# EAGLE design Debug (EAGLE 9.4.2)
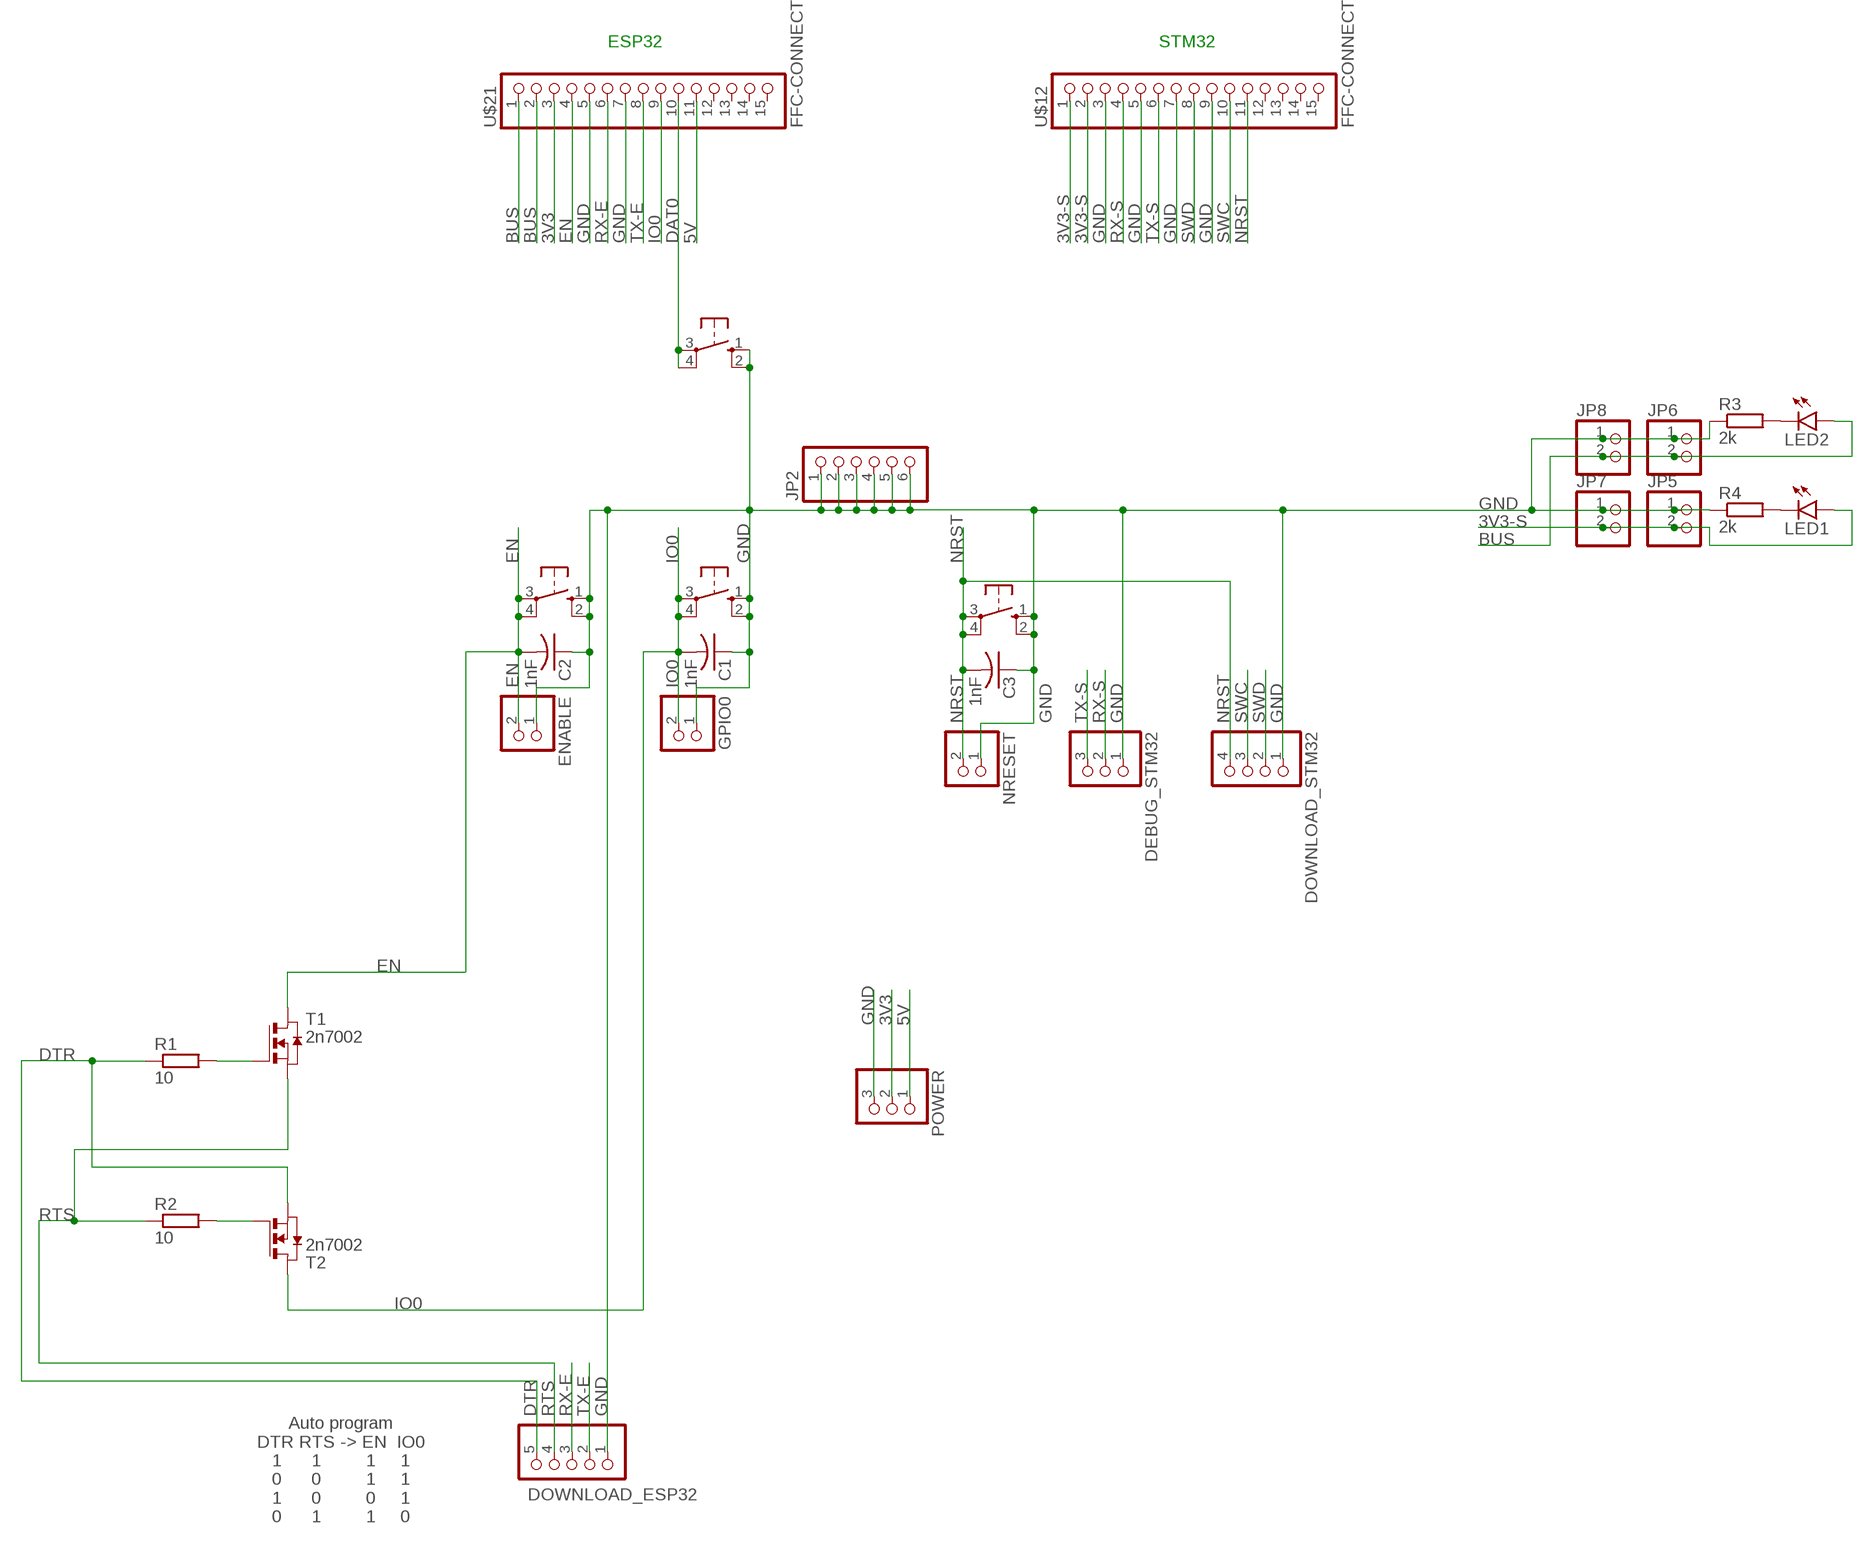
[diagram p0: schematic, sheet 1]

## Parts
C1  1nF  C-USC0603  [C0603]
C2  1nF  C-USC0603  [C0603]
C3  1nF  C-USC0603  [C0603]
DAT0  10-XX  [B3F-10XX]
DEBUG_STM32  PINHD-1X3  [1X03]
DOWNLOAD_ESP32  PINHD-1X5  [1X05]
DOWNLOAD_STM32  PINHD-1X4  [1X04]
EN  10-XX  [B3F-10XX]
ENABLE  PINHD-1X2  [1X02]
GPIO0  PINHD-1X2  [1X02]
IO0  10-XX  [B3F-10XX]
JP2  PINHD-1X6  [1X06]
JP5  PINHD-1X2  [1X02]
JP6  PINHD-1X2  [1X02]
JP7  PINHD-1X2  [1X02]
JP8  PINHD-1X2  [1X02]
LED1  LEDCHIPLED_0603  [CHIPLED_0603]
LED2  LEDCHIPLED_0603  [CHIPLED_0603]
NRESET  PINHD-1X2  [1X02]
NRST  10-XX  [B3F-10XX]
POWER  PINHD-1X3  [1X03]
R1  10  R-EU_R0603  [R0603]
R2  10  R-EU_R0603  [R0603]
R3  2k  R-EU_R0603  [R0603]
R4  2k  R-EU_R0603  [R0603]
T1  2n7002  NMOSSOT23  [SOT-23]
T2  2n7002  NMOSSOT23  [SOT-23]
U$12  FFC-CONNECT  [SLW15S]
U$21  FFC-CONNECT  [SLW15S]

## Nets
3V3: POWER.2 U$21.3
3V3-S: JP5.2 JP7.2 LED1.A U$12.1 U$12.2
5V: POWER.1 U$21.11
BUS: JP6.2 JP8.2 LED2.A U$21.1 U$21.2
DAT0: DAT0.3(P) DAT0.4(P1) U$21.10
DTR: DOWNLOAD_ESP32.5 R1.1 T2.2(S)
EN: C2.2 EN.3(P) EN.4(P1) ENABLE.2 T1.1(D) U$21.4
GND: C1.1 C2.1 C3.1 DAT0.1(S) DAT0.2(S1) DEBUG_STM32.1 DOWNLOAD_ESP32.1 DOWNLOAD_STM32.1 EN.1(S) EN.2(S1) ENABLE.1 GPIO0.1 IO0.1(S) IO0.2(S1) JP2.1 JP2.2 JP2.3 JP2.4 JP2.5 JP2.6 JP5.1 JP6.1 JP7.1 JP8.1 NRESET.1 NRST.1(S) NRST.2(S1) POWER.3 R3.1 R4.1 U$12.3 U$12.5 U$12.7 U$12.9 U$21.5 U$21.7
IO0: C1.2 GPIO0.2 IO0.3(P) IO0.4(P1) T2.1(D) U$21.9
N$1: R2.2 T2.3(G)
N$2: R1.2 T1.3(G)
N$3: LED1.C R4.2
N$4: LED2.C R3.2
NRST: C3.2 DOWNLOAD_STM32.4 NRESET.2 NRST.3(P) NRST.4(P1) U$12.11
RTS: DOWNLOAD_ESP32.4 R2.1 T1.2(S)
RX-E: DOWNLOAD_ESP32.3 U$21.6
RX-S: DEBUG_STM32.2 U$12.4
SWC: DOWNLOAD_STM32.3 U$12.10
SWD: DOWNLOAD_STM32.2 U$12.8
TX-E: DOWNLOAD_ESP32.2 U$21.8
TX-S: DEBUG_STM32.3 U$12.6
Unconnected: U$12.12 U$12.13 U$12.14 U$12.15 U$21.12 U$21.13 U$21.14 U$21.15

## Notes on the sheet
- ESP32 | STM32
- Auto program
  DTR RTS -> EN  IO0
  1      1         1     1
  0      0         1     1
  1      0         0     1
  0      1         1     0

## Library data of the parts
C1-C3 = rcl:C-US: CAPACITOR, American symbol; SPICEPREFIX: C
DAT0 EN IO0 NRST = switch-omron:10-XX: OMRON SWITCH; MPN: B3F-1000; OC_FARNELL: 176432; OC_NEWARK: 36M3542
DEBUG_STM32 POWER = pinhead:PINHD-1X3: PIN HEADER
DOWNLOAD_ESP32 = pinhead:PINHD-1X5: PIN HEADER
DOWNLOAD_STM32 = pinhead:PINHD-1X4: PIN HEADER
ENABLE GPIO0 JP5-JP8 NRESET = pinhead:PINHD-1X2: PIN HEADER
JP2 = pinhead:PINHD-1X6: PIN HEADER
LED1 LED2 = led:LED: LED OSRAM: - CHIPLED LG R971, LG N971, LY N971, LG Q971, LY Q971, LO R971, LY R971 LH N974, LH R974 LS Q976, LO Q976, LY Q976 LO Q996 - Hyper CHIPLED LW Q18S LB Q993, LB Q99A, LB R99A - SideLED LS A670, LO A670, LY A670, LG A670, LP A670 LB A673, LV A673, LT A673, LW A673 LH A674 LY A675 LS A676, LA A676, LO A676, LY A676, LW A676 LS A679, LY A679, LG A679 - Hyper Micro SIDELED® LS Y876, LA Y876, LO Y876, LY Y876 LT Y87S - SmartLED LW L88C, LW L88S LB L89C, LB L89S, LG L890 LS L89K, LO L89K, LY L89K LS L896, LA L896, LO L896, LY L896 - TOPLED LS T670, LO T670, LY T670, LG T670, LP T670 LSG T670, LSP T670, LSY T670, LOP T670, LYG T670 LG T671, LOG T671, LSG T671 LB T673, LV T673, LT T673, LW T673 LH T674 LS T676, LA T676, LO T676, LY T676, LB T676, LH T676, LSB T676, LW T676 LB T67C, LV T67C, LT T67C, LS T67K, LO T67K, LY T67K, LW E67C LS E67B, LA E67B, LO E67B, LY E67B, LB E67C, LV E67C, LT E67C LW T67C LS T679, LY T679, LG T679 LS T770, LO T770, LY T770, LG T770, LP T770 LB T773, LV T773, LT T773, LW T773 LH T774 LS E675, LA E675, LY E675, LS T675 LS T776, LA T776, LO T776, LY T776, LB T776 LHGB T686 LT T68C, LB T68C - Hyper Mini TOPLED® LB M676 - Mini TOPLED Santana® LG M470 LS M47K, LO M47K, LY M47K Source: http://www.osram.convergy.de LUXEON: - LUMILED® LXK2-PW12-R00, LXK2-PW12-S00, LXK2-PW14-U00, LXK2-PW14-V00 LXK2-PM12-R00, LXK2-PM12-S00, LXK2-PM14-U00 LXK2-PE12-Q00, LXK2-PE12-R00, LXK2-PE12-S00, LXK2-PE14-T00, LXK2-PE14-U00 LXK2-PB12-K00, LXK2-PB12-L00, LXK2-PB12-M00, LXK2-PB14-N00, LXK2-PB14-P00, LXK2-PB14-Q00 LXK2-PR12-L00, LXK2-PR12-M00, LXK2-PR14-Q00, LXK2-PR14-R00 LXK2-PD12-Q00, LXK2-PD12-R00, LXK2-PD12-S00 LXK2-PH12-R00, LXK2-PH12-S00 LXK2-PL12-P00, LXK2-PL12-Q00, LXK2-PL12-R00 Source: www.luxeon.com KINGBRIGHT: KA-3528ASYC Source: www.kingbright.com
R1-R4 = rcl:R-EU_: RESISTOR, European symbol; SPICEPREFIX: R
T1 T2 = zetex:NMOSSOT23: MOS FET; OC_FARNELL: unknown; OC_NEWARK: unknown
U$12 U$21 = CanCubeSat:FFC-CONNECT

## Board
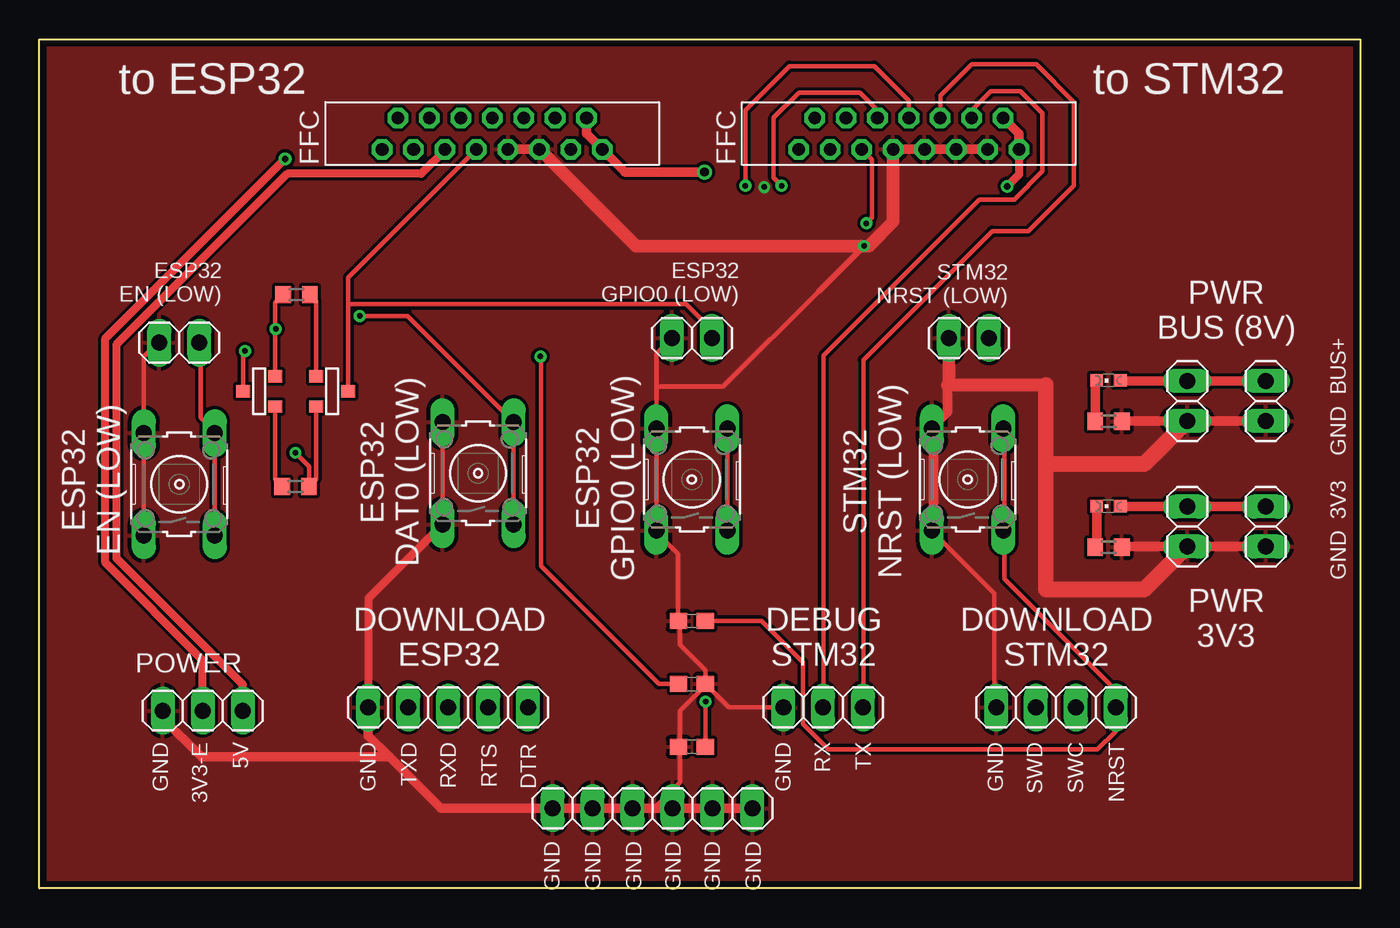
[diagram p1: board, top side]
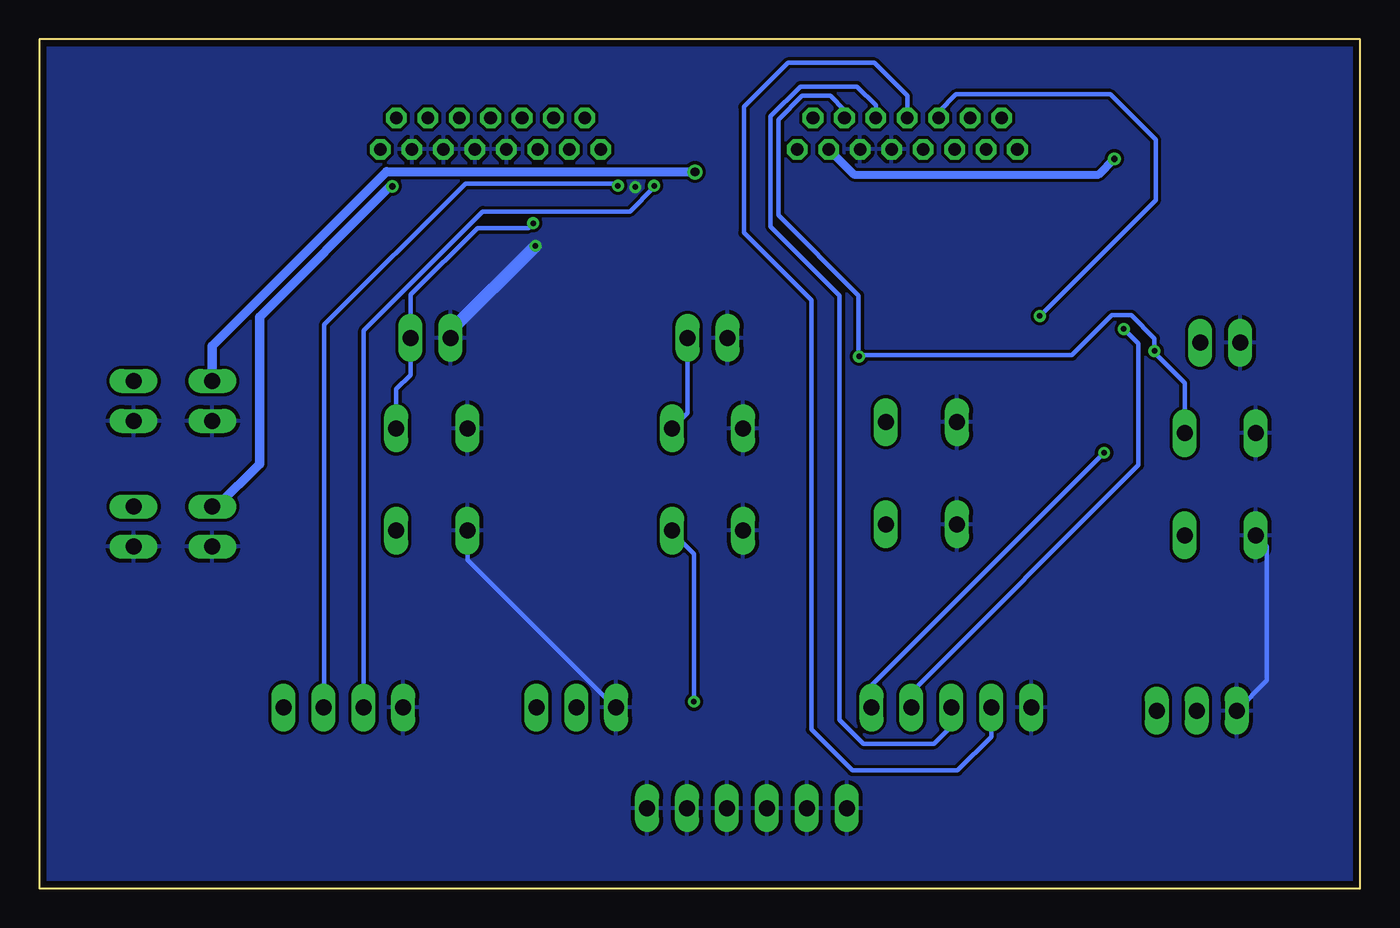
[diagram p2: board, bottom side, seen from below]

Size 84 x 54 mm. Coordinates in mm from the lower left corner, seen from the top.
Outline: 0,0 0,54 84,54 84,0 0,0
Copper layers (1*16): Top 0.035mm / dielectric 1.5mm / Bottom 0.035mm
Design rules "default *": minimum track width 0.3mm, minimum drill 0.35mm, track to track 0.2mm, track to pad 0.2mm, pad to pad 0.2mm, via to via 0.2mm, smd to smd 0.2mm, copper to edge 0.4mm, drill to drill 6mil, minimum pad ring 10mil, minimum via ring 8mil, stop-mask expansion 4mil, vias tented up to drill 0mil, thermal gap 10mil

### Footprints (pad centres in the part's own frame; a part is rotated, then mirrored left to right if it is on the bottom)
C0603 = smd 1.1 x 1: 1 -0.85,0; 2 0.85,0
B3F-10XX = drill 1.016 long: 1 -3.251,2.261; 2 3.251,2.261; 3 -3.251,-2.261; 4 3.251,-2.261
1X03 = drill 1.016 long: 1 -2.54,0; 2 0,0; 3 2.54,0
1X05 = drill 1.016 long: 1 -5.08,0; 2 -2.54,0; 3 0,0; 4 2.54,0; 5 5.08,0
1X04 = drill 1.016 long: 1 -3.81,0; 2 -1.27,0; 3 1.27,0; 4 3.81,0
1X02 = drill 1.016 long: 1 -1.27,0; 2 1.27,0
1X06 = drill 1.016 long: 1 -6.35,0; 2 -3.81,0; 3 -1.27,0; 4 1.27,0; 5 3.81,0; 6 6.35,0
CHIPLED_0603 = smd 0.8 x 0.8: A 0,-0.75; C 0,0.75
R0603 = smd 1 x 1.1: 1 -0.85,0; 2 0.85,0
SOT-23 = smd 0.787 x 0.889: 1 0.025,-1.016; 2 -0.94,1.016; 3 0.991,1.016
SLW15S = drill 0.8 octagon: 1 7,-1; 2 6,1; 3 5,-1; 4 4,1; 5 3,-1; 6 2,1; 7 1,-1; 8 0,1; 9 -1,-1; 10 -2,1; 11 -3,-1; 12 -4,1; 13 -5,-1; 14 -6,1; 15 -7,-1

### Placement (x,y rotation side)
C1  41.5,9 0 top
C2  41.5,13 180 top
C3  41.5,17 0 top
DAT0  27.9,26.4 90 top
DEBUG_STM32  49.85,11.5 0 top
DOWNLOAD_ESP32  26,11.5 0 top
DOWNLOAD_STM32  64.66,11.5 0 top
EN  8.9,25.7 90 top
ENABLE  8.9,34.7 0 top
GPIO0  41.5,35 0 top
IO0  41.5,26 90 top
JP2  39,5.09 0 top
JP5  73,23 90 top
JP6  73,31 90 top
JP7  78,23 90 top
JP8  78,31 90 top
LED1  68,24.3 90 top
LED2  68,32.3 90 top
NRESET  59.12,35 0 top
NRST  59.04,26 90 top
POWER  10.4,11.3 180 top
R1  16.3,25.56 180 top
R2  16.35,37.76 0 top
R3  68,29.7 180 top
R4  68,21.7 180 top
T1  13.99,31.63 270 top
T2  18.62,31.58 90 top
U$12  55.3,48 0 top
U$21  28.8,48 0 top

### Tracks (layer width: path | path; a pad name or v marks a point on that pad's centre or on a via)
3V3  (via drill 0.4)
  Top 0.5: POWER.2 10.4,14.51 4.2,20.71 4.2,34.97 v15.63,46.4
  Bottom 0.5: v15.63,46.4 16.64,45.4 32.2,45.4 U$21.3
3V3-S  (via drill 0.4)
  Top 0.5: U$12.1 62.3,45.4 v61.55,44.65
  Top 0.6: JP7.2 JP5.2 68.78,24.27 LED1.A | U$12.2 62.3,48 U$12.1
  Bottom 0.5: v61.55,44.65 61.62,44.72
  Bottom 0.6: 61.62,44.72 70,36.34 70,27 72.73,24.27 JP5.2
5V
  Top 0.5: U$21.11 25.8,46.96 24.29,45.45 15.78,45.45 4.9,34.58 4.9,21 12.94,12.96 POWER.1
BUS  (via drill 0.55)
  Top 0.6: JP8.2 JP6.2 68.78,32.27 LED2.A | U$21.2 34.8,48 U$21.1 37.24,45.56 v42.3,45.56
  Bottom 0.6: JP6.2 73,34.48 61.9,45.57 v42.3,45.56
DAT0  (via drill 0.35)
  Top 0.3: DAT0.3 DAT0.4 23.41,36.4 v20.38,36.4
  Bottom 0.3: U$21.10 26.8,49.4 25.7,50.5 15.9,50.5 13,47.6 13,43.77 v20.37,36.4 v20.38,36.4
DTR  (via drill 0.35)
  Top 0.3: T2.2 17.6,26.01 R1.1 17.15,26.84 v16.29,27.7
  Bottom 0.3: DOWNLOAD_ESP32.5 31.08,12.91 v16.29,27.7
EN  (via drill 0.35)
  Top 0.3: EN.3 EN.4 11.15,29.07 10.28,29.95 10.28,34.7 ENABLE.2 | T1.1 12.97,34.07 v13.08,34.18 | C2.2 39.4,13 31.9,20.5 31.9,33.79 v31.86,33.83
  Bottom 0.3: EN.4 11.16,32.15 13.08,34.07 v13.08,34.18 13.08,34.98 14.55,36.45 15.78,36.45 18.33,33.9 31.79,33.9 v31.86,33.83 31.9,33.86 31.9,37.7 37,42.8 37,48.9 35.5,50.4 33.7,50.4 32.8,49.5 U$21.4
GND  (via drill 0.35)
  Top 0.3: 56.88,22.75 NRST.1 56.88,22.62 60.75,18.75 60.75,11.5 DOWNLOAD_STM32.1 | 56.88,29.25 NRST.2 56.88,29.38 | EN.1 EN.2 6.65,29.07 6.65,33.83 7.53,34.7 ENABLE.1 | 40.75,9 40.75,11.3 42.35,12.9 C2.1 | 40.75,9 C1.1 | C2.1 42.35,13.88 40.75,15.47 40.75,17 C3.1 40.62,17 40.62,21.25 39.25,22.62 IO0.1 IO0.2 39.24,31.9 | DEBUG_STM32.1 43.88,11.5 42.38,13 C2.1 | 39.24,31.9 39.24,34.01 GPIO0.1 | 40.75,9 40.75,6.74 39.1,5.09 | DAT0.2 DAT0.1 | 49.62,38.02 43.49,31.9 39.24,31.9
  Top 0.4: v52.45,40.86 49.62,38.02
  Top 0.5: DAT0.1 20.92,18.43 DOWNLOAD_ESP32.1
  Top 0.6: 56.88,29.25 56.88,22.75 | 57.75,32 57.75,30.25 56.88,29.38 | JP8.1 JP6.1 68.88,29.73 R3.1 | JP7.1 JP5.1 68.88,21.73 R4.1 | JP2.6 JP2.5 JP2.4 39.1,5.09 JP2.3 JP2.2 JP2.1 25.54,5.09 22.26,8.36 | 22.26,8.36 20.92,9.71 DOWNLOAD_ESP32.1 | 22.26,8.36 10.32,8.36 7.86,10.82 POWER.3 | U$21.5 U$21.7 | U$12.3 U$12.5 U$12.7 U$12.9
  Top 0.8: U$12.9 54.3,42.41 52.75,40.86 v52.45,40.86 37.94,40.86 U$21.5 | 64,32 57.75,32 57.85,32.1 NRESET.1
  Top 1: 64,32 64,27 | 64,27 64,19 70.27,19 JP5.1 | JP6.1 70.27,27 64,27
  Bottom 0.3: EN.1 6.53,22.32 5.95,21.75 5.95,13.21 POWER.3 | NRST.1 56.75,22.62 56.75,20.88 47.38,11.5 DEBUG_STM32.1
  Bottom 0.8: NRESET.1 57.85,35.46 v52.45,40.86
  other vias: 46.1,44.6
  pour Top: 0.4,53.6 83.6,53.6 83.6,0.4 0.4,0.4
  pour Bottom: 0.4,53.6 83.6,53.6 83.6,0.4 0.4,0.4
IO0  (via drill 0.35)
  Top 0.3: v42.38,11.88 42.38,9 C1.2 | IO0.4 IO0.3 | 19.65,37.15 T2.1 | U$21.9 19.65,38.85 19.65,37.15 | 19.65,37.15 41.12,37.15 42.77,35.5 GPIO0.2
  Bottom 0.3: v42.38,11.88 42.38,21.25 43.75,22.62 IO0.3 | IO0.4 42.77,30.24 GPIO0.2
N$1
  Top 0.3: T2.3 17.6,37.36 R2.2
N$2
  Top 0.3: T1.3 15.01,26 R1.2
N$3
  Top 0.6: LED1.C 67.25,21.8 R4.2
N$4
  Top 0.6: R3.2 67.15,32.2 LED2.C
NRST  (via drill 0.35)
  Top 0.3: NRST.4 61.38,29.25 61.38,22.75 NRST.3 61.38,22.62 61.38,19.68 68.47,12.58 DOWNLOAD_STM32.4 68.47,9.99 67.3,8.82 50.17,8.82 48.55,10.45 48.55,14.38 45.92,17 C3.2 | U$12.11 52.95,46.35 52.95,42.65 v52.6,42.3
  Bottom 0.3: NRST.4 61.3,31.75 60.39,32.66 NRESET.2 60.39,37.75 56.14,42 52.9,42 v52.6,42.3
RTS  (via drill 0.35)
  Top 0.3: T1.2 15.01,35.58 | 15.01,35.58 15.01,37.27 R2.1 | v15.03,35.58 15.01,35.58
  Bottom 0.3: DOWNLOAD_ESP32.4 28.54,12.47 14.1,26.91 14.1,34.65 v15.03,35.58
RX-E
  Bottom 0.3: U$21.6 30.8,49.8 32,51 35.61,51 37.5,49.11 37.5,42.1 33.1,37.7 33.1,10.7 31.6,9.2 27.1,9.2 26,10.3 DOWNLOAD_ESP32.3
RX-S
  Top 0.3: DEBUG_STM32.2 49.88,11.5 49.88,33.88 59.8,43.8 62,43.8 63.8,45.6 63.8,49.3 62.4,50.7 60.5,50.7 59.3,49.5 U$12.4
SWC  (via drill 0.35)
  Top 0.3: v47.2,44.69 46.7,45.19 46.7,49 48.3,50.6 52.2,50.6 53.3,49.5 U$12.10
  Bottom 0.3: DOWNLOAD_STM32.3 65.88,11.5 65.88,35.85 56.91,44.82 47.33,44.82 v47.2,44.69
SWD  (via drill 0.35)
  Top 0.3: v44.9,44.69 44.9,49.5 47.7,52.3 53.1,52.3 55.3,50.1 U$12.8
  Bottom 0.3: DOWNLOAD_STM32.2 63.38,11.5 63.38,35.48 55.81,43.04 46.45,43.04 44.9,44.59 v44.9,44.69
TX-E
  Bottom 0.3: U$21.8 28.8,50.4 30.9,52.5 36.4,52.5 39.2,49.7 39.2,41.7 34.9,37.4 34.9,10.1 32.3,7.5 25.6,7.5 23.46,9.64 DOWNLOAD_ESP32.2
TX-S
  Top 0.3: DEBUG_STM32.3 52.4,33.6 60.6,41.8 62.9,41.8 65.8,44.7 65.8,50 63.4,52.4 59.3,52.4 57.3,50.4 U$12.6

### Text on the board
tNames: to ESP32 | to STM32 | ESP32 / EN (LOW) | ESP32 / GPIO0 (LOW) | STM32 / NRST (LOW) | PWR / BUS (8V) | BUS+ | GND | ESP32 / EN (LOW) | ESP32 / DAT0 (LOW) | ESP32 / GPIO0 (LOW) | STM32 / NRST (LOW) | 3V3 | GND | PWR / 3V3 | DOWNLOAD / ESP32 | DEBUG / STM32 | DOWNLOAD / STM32 | GND | 3V3-E | 5V | GND | TXD | RXD | RTS | DTR | GND | RX | TX | GND | SWD | SWC | NRST | GND | GND | GND | GND | GND | GND